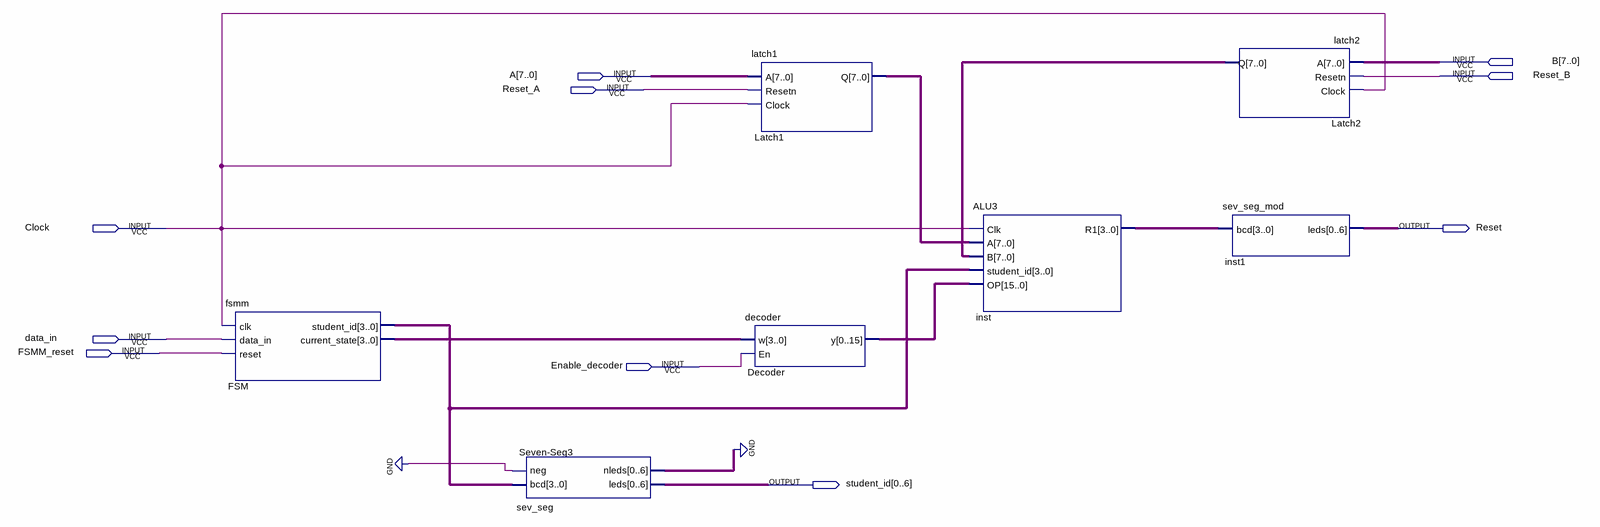
[diagram p0: schematic sheet]
// Quartus schematic GPU-ALU3.bdf as structural Verilog: 7 symbols, 10 pins
module \GPU-ALU3  (
  input  [7:0] B,
  input  [7:0] A,
  input  Reset_B,
  input  Reset_A,
  input  Clock,
  input  data_in,
  input  FSMM_reset,
  input  Enable_decoder,
  output Reset,
  output [0:6] student_id
);

  wire [3:0] FSM_current_state, FSM_student_id, inst_r1;
  wire [6:0] inst1_leds, Seven_Seg3_nleds;
  wire [7:0] Latch1_q, Latch2_q;
  wire [15:0] Decoder_y;

  fsmm FSM (
    .clk(Clock), .data_in(data_in), .reset(FSMM_reset), .student_id(FSM_student_id),
    .current_state(FSM_current_state));
  sev_seg \Seven-Seg3  (.bcd(FSM_student_id), .neg(1'b0), .leds(student_id), .nleds(Seven_Seg3_nleds));
  latch1 Latch1 (.A(A), .Resetn(Reset_A), .Clock(Clock), .Q(Latch1_q));
  decoder Decoder (.w(FSM_current_state), .En(Enable_decoder), .y(Decoder_y));
  ALU3 inst (.Clk(Clock), .A(Latch1_q), .B(Latch2_q), .student_id(FSM_student_id), .OP(Decoder_y), .R1(inst_r1));
  latch2 Latch2 (.A(B), .Resetn(Reset_B), .Clock(Clock), .Q(Latch2_q));
  sev_seg_mod inst1 (.bcd(inst_r1), .leds(inst1_leds));
  // also tied to GND on the sheet: {Seven_Seg3_nleds[0], Seven_Seg3_nleds[1], Seven_Seg3_nleds[2], Seven_Seg3_nleds[3], Seven_Seg3_nleds[4], Seven_Seg3_nleds[5], Seven_Seg3_nleds[6]}
endmodule
